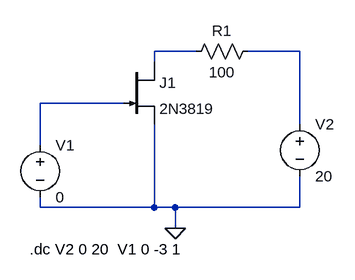
[diagram p0: schematic N-JFETa.asc]
N-JFETa.asc, the LTspice schematic file:
Version 4
SHEET 1 880 680
WIRE 272 16 208 16
WIRE 432 16 352 16
WIRE 208 32 208 16
WIRE 160 96 32 96
WIRE 432 128 432 16
WIRE 32 160 32 96
WIRE 32 256 32 240
WIRE 208 256 208 128
WIRE 208 256 32 256
WIRE 240 256 208 256
WIRE 432 256 432 208
WIRE 432 256 240 256
WIRE 240 288 240 256
FLAG 240 288 0
SYMBOL voltage 32 144 R0
WINDOW 123 0 0 Left 0
WINDOW 39 0 0 Left 0
SYMATTR InstName V1
SYMATTR Value 0
SYMBOL voltage 432 112 R0
WINDOW 123 0 0 Left 0
WINDOW 39 0 0 Left 0
SYMATTR InstName V2
SYMATTR Value 20
SYMBOL res 368 0 R90
WINDOW 0 0 56 VBottom 2
WINDOW 3 32 56 VTop 2
SYMATTR InstName R1
SYMATTR Value 100
SYMBOL njf 160 32 R0
SYMATTR InstName J1
SYMATTR Value 2N3819
TEXT 16 320 Left 2 !.dc V2 0 20  V1 0 -3 1

The netlist it stands for:
* N-JFETa.asc
V1 N003 0 0
V2 N002 0 20
R1 N002 N001 100
J1 N001 N003 0 2N3819
.model NJF NJF
.model PJF PJF
.lib standard.jft
.dc V2 0 20  V1 0 -3 1
.backanno
.end